# EasyEDA schematic SCC_MPPT_EASYEDA_Schematic.json
TITLE: New Schematic; REV: 1.0; Date: 2019-01-09; Sheet: 1/1; Drawn By: wira1262
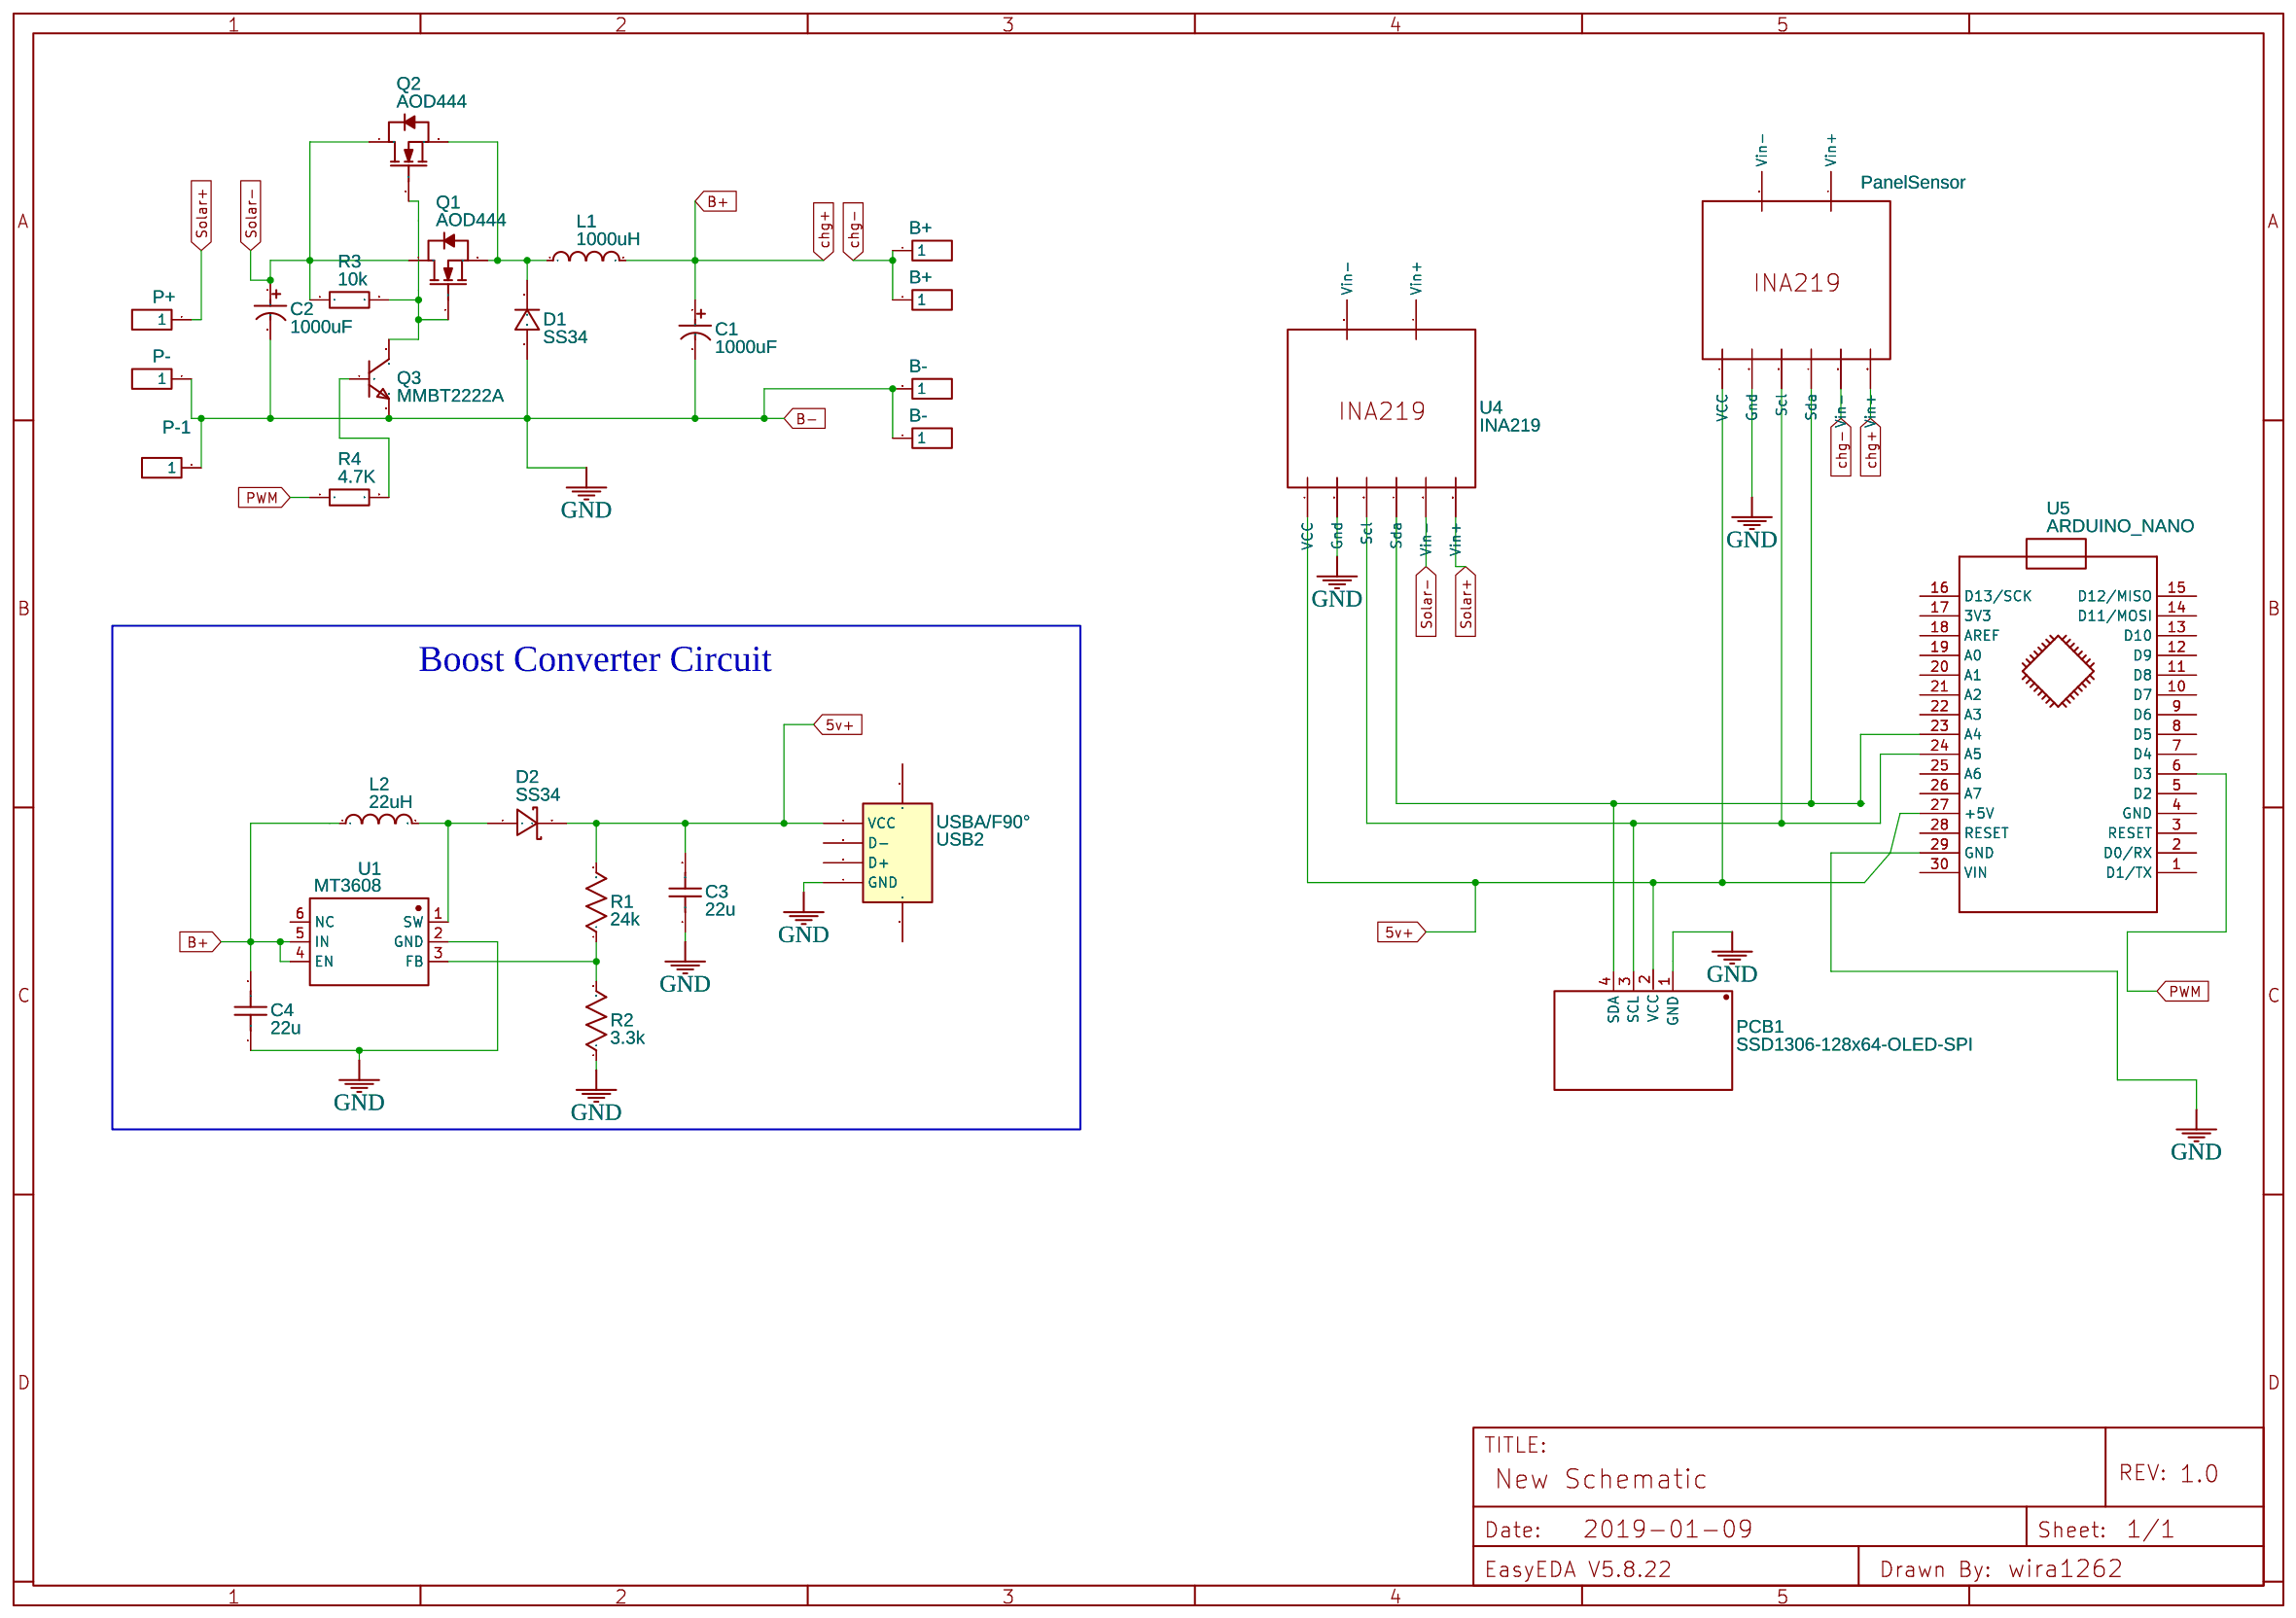
[diagram p0: schematic sheet]

## Parts
B+1  B+  [HDR-1X1/2.54]
B+2  B+  [HDR-1X1/2.54]
B-1  B-  [HDR-1X1/2.54]
B-2  B-  [HDR-1X1/2.54]
C1  1000uF  [CAP-D10.0XF5.0]
C2  1000uF  [CAP-D10.0XF5.0]
C3  22u  [0805]
C4  22u  [0805]
D1  SS34  [SMC(DO-214AB)]
D2  SS34  [SMA(DO-214AC)]
L1  1000uH  [DIP-L-12.5X14.5]
L2  22uH  [CD43]
P+  P+  [HDR-1X1/2.54]
P-  P-  [HDR-1X1/2.54]
P-1  Header-Male-2.54_1x1  [HDR-1X1/2.54]
PCB1  SSD1306-128x64-OLED-SPI  [SSD1306_ARDUINO]
Q1  AOD444  [TO-252-2]
Q2  AOD444  [TO-252-2]
Q3  MMBT2222A  [SOT-23(SOT-23-3)]
R1  24k  [0603]
R2  3.3k  [0603]
R3  10k  [1206]
R4  4.7K  [1206]
U1  MT3608  [SOT-23-6]
U3  PanelSensor  [INA219-AURDINO]
U4  INA219  [INA219-AURDINO]
U5  ARDUINO_NANO  [ARDUINO_NANO]
USB2  USBA/F90°  [USB-M-46]

## Library data of the parts
B+1 B+2 B-1 B-2 P+ P- = -: Supplier: LCSC; Manufacturer: ReliaPro; Manufacturer Part: Header-Male-2.54_1x1; Supplier Part: C81276
C1 C2 = 1000uF 25V: Supplier: LCSC; Manufacturer: ValuePro; Supplier Part: C10750
C3 C4 = Cap_0805_US: Manufacturer Part: ?
D1 = -: Supplier Part: C169162; Supplier: LCSC; Manufacturer: DIOFIT; Contributor: LCSC
D2 = -: Supplier: LCSC; Manufacturer: MDD; image: //image.lceda.cn/szlcsc/C8678.jpg; Supplier Part: C8678
L1 = VLU1012-102KB: Supplier: LCSC; Manufacturer: FH; Contributor: LCSC; Supplier Part: C142469
L2 = SWRH0704B-220MT: Supplier: LCSC; Manufacturer: Sunlord; Contributor: LCSC; Supplier Part: C127734
P-1 = -: Supplier: LCSC; Manufacturer: ReliaPro; Supplier Part: C81276
PCB1 = -: sourceId: wICUcuL3l; Manufacturer Part: ?
Q1 Q2 = -: Supplier: LCSC; Manufacturer: AOS; image: //image.lceda.cn/szlcsc/C33216.jpg; Supplier Part: C33216
Q3 = -: Supplier Part: C171740; Supplier: LCSC; Manufacturer: SK; Contributor: LCSC
R1 R2 = Res_0603(1/10W)_US: Manufacturer Part: ?
R3 = PTFR1206B10K0P9: Supplier: LCSC; Supplier Part: C351536; Manufacturer: ResistorToday; Contributor: LCSC
R4 = PTFR1206B4K70P9: Supplier: LCSC; Supplier Part: C351460; Manufacturer: ResistorToday; Contributor: LCSC
U1 = -: Supplier: LCSC; Manufacturer: AEROSEMI; Contributor: LCSC; Supplier Part: C84817
U3 = -: Manufacturer Part: INA219; Supplier Part: INA219; Supplier: AdaFruit; link: https://www.adafruit.com/product/904; Contributor: Mage34
U4 = -: Supplier: AdaFruit; link: https://www.adafruit.com/product/904; Contributor: Mage34
U5 = -: sourceId: KGSeAWhDB; Manufacturer Part: ?
USB2 = -: Supplier: LCSC; Manufacturer: ValuePro; image: //image.lceda.cn/szlcsc/C44334.jpg; Contributor: LCSC; Supplier Part: C44334

## Nets
5v+: C3.2 D2.2(K) PCB1.2(VCC) R1.2 U3.1(VCC) U4.1(VCC) U5.27(+5V) USB2.1(VCC)
B+: C1.1 C4.2 L1.2 L2.1 U1.4(EN) U1.5(IN) U3.6(Vin+)
B-: B-1.1 B-2.1 C1.2 C2.2 C3.1 C4.1 D1.1 P-.1 P-1.1 PCB1.1(GND) Q3.2(E) R2.1 U1.2(GND) U3.2(Gnd) U4.2(Gnd) U5.29(GND) USB2.4(GND)
chg-: B+1.1 B+2.1 U3.5(Vin-)
PWM: R4.1 U5.6(D3)
Solar+: P+.1 U4.6(Vin+)
Solar-: C2.1 Q1.4(D) Q2.4(D) R3.1 U4.5(Vin-)
Net-(D1-2): D1.2 L1.1 Q1.3(S) Q2.3(S)
Net-(D2-1): D2.1(A) L2.2 U1.1(SW)
Net-(PCB1-3): PCB1.3(SCL) U3.3(Scl) U4.3(Scl) U5.24(A5)
Net-(PCB1-4): PCB1.4(SDA) U3.4(Sda) U4.4(Sda) U5.23(A4)
Net-(Q1-1): Q1.1(G) Q2.1(G) Q3.3(C) R3.2
Net-(Q3-1): Q3.1(B) R4.2
Net-(R1-1): R1.1 R2.2 U1.3(FB)

Not connected (* = marked no-connect by the designer): U1 6(NC); U3 7(Vin+) 8(Vin-); U4 7(Vin+) 8(Vin-); U5 1(D1/TX) 2(D0/RX) 3(RESET) 4(GND) 5(D2) 7(D4) 8(D5) 9(D6) 10(D7) 11(D8) 12(D9) 13(D10) 14(D11/MOSI) 15(D12/MISO) 16(D13/SCK) 17(3V3) 18(AREF) 19(A0) 20(A1) 21(A2) 22(A3) 25(A6) 26(A7) 28(RESET) 30(VIN); USB2 0 2(D-) 3(D+)

## Notes on the sheet
- Boost Converter Circuit
